# Altium schematic sheet SX1250.SchDoc: SX1250
size A4; Author: Lucas Liaño; Revision: 1; SheetNumber: 4; SheetTotal: 8
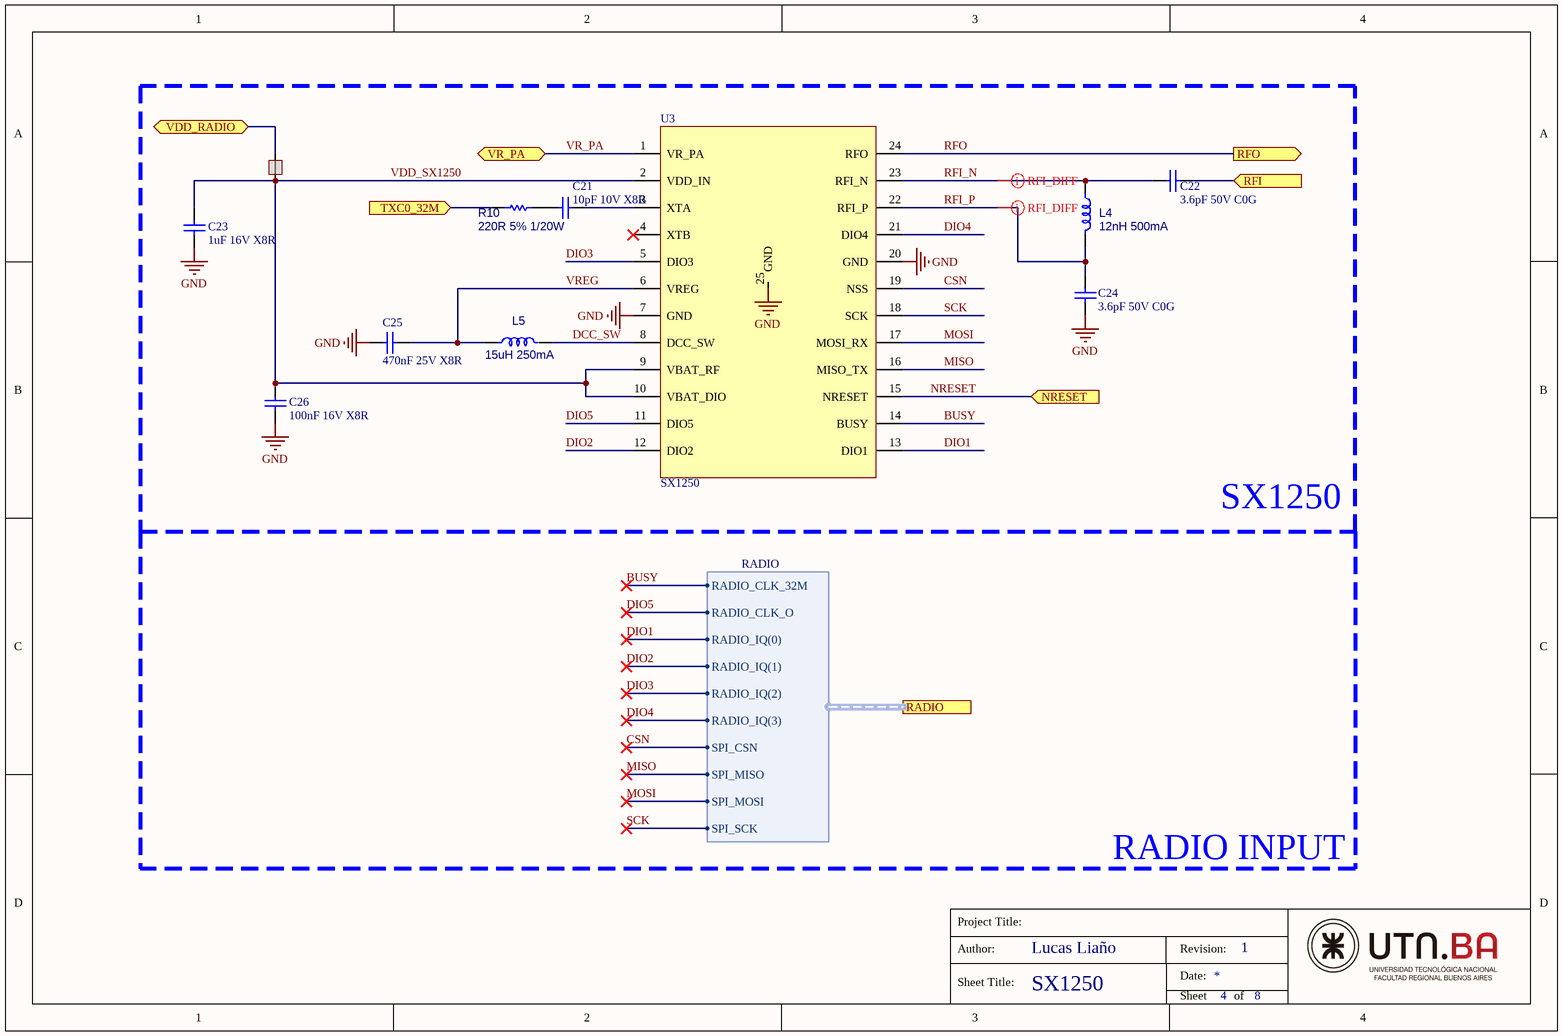
[diagram p0: SX1250.SchDoc]

## Parts
C21  10pF 10V X8R  [C_0603]
C22  3.6pF 50V C0G  [C_0603]
C23  1uF 16V X8R  [C_0603]
C24  3.6pF 50V C0G  [C_0603]
C25  470nF 25V X8R  [C_0603]
C26  100nF 16V X8R  [C_0603]
L4  12nH 500mA  [L_0402]
L5  15uH 250mA  [0805[2012]]
NT16  NT  [NTIE24]  (value not drawn)  (net tie, no BOM)
R10  220R 5% 1/20W  [0603[1608]]
U3  SX1250  [vqfn24_4x4mm]

## Blocks framed on the sheet
SX1250: C21-C26 L4 L5 NT16 R10 U3

## Ports
NRESET (in), RADIO (harness RADIO), RFI (in), RFO (out), TXC0_32M (in), VDD_RADIO (bidir), VR_PA (bidir)

## Harnesses
RADIO: RADIO_CLK_32M, RADIO_CLK_O, RADIO_IQ(0), RADIO_IQ(1), RADIO_IQ(2), RADIO_IQ(3), SPI_CSN, SPI_MISO, SPI_MOSI, SPI_SCK

## Nets
GND: C23.2 C24.2 C25.2 C26.2 U3.7(GND) U3.20(GND) U3.25(GND)
BUSY: U3.14(BUSY) ; port RADIO.RADIO_CLK_32M
CSN: U3.19(NSS) ; port RADIO.SPI_CSN
DCC_SW: L5.2 U3.8(DCC_SW)
DIO1: U3.13(DIO1) ; port RADIO.RADIO_IQ(0)
DIO2: U3.12(DIO2) ; port RADIO.RADIO_IQ(1)
DIO3: U3.5(DIO3) ; port RADIO.RADIO_IQ(2)
DIO4: U3.21(DIO4) ; port RADIO.RADIO_IQ(3)
DIO5: U3.11(DIO5) ; port RADIO.RADIO_CLK_O
MISO: U3.16(MISO_TX) ; port RADIO.SPI_MISO
MOSI: U3.17(MOSI_RX) ; port RADIO.SPI_MOSI
NRESET: U3.15(NRESET) ; port NRESET
RFI: C22.2 ; port RFI
RFI_N: C22.1 L4.1 U3.23(RFI_N)
RFI_P: C24.1 L4.2 U3.22(RFI_P)
RFO: U3.24(RFO) ; port RFO
SCK: U3.18(SCK) ; port RADIO.SPI_SCK
TXC0_32M: R10.1 ; port TXC0_32M
VDD_RADIO: NT16.2 ; port VDD_RADIO
VDD_SX1250: C23.1 C26.1 NT16.1 U3.2(VDD_IN) U3.9(VBAT_RF) U3.10(VBAT_DIO)
VR_PA: U3.1(VR_PA) ; port VR_PA
VREG: C25.1 L5.1 U3.6(VREG)
NetC21_1: C21.1 U3.3(XTA)
NetC21_2: C21.2 R10.2

Not connected (* = marked no-connect by the designer): U3 4(XTB)*

## Layout directives
differential pair; differential pair class RFI_DIFF: RFI_N, RFI_P

## Notes on the sheet
- Project Title:
- RADIO INPUT
- Author:
- Sheet Title:
- Date:
- Revision:
- Sheet
- of

## Library data of the parts
C21 = Cap: Capacitor; MPN: C0603X100J8HACAUTO; Manufacturer: KEMET; Package: 0603; Price (USD): 0.1; ComponentLink2Description: SupplierLink; ComponentLink1Description: Datasheet; ComponentLink2URL: https://www.digikey.com/es/products/detail/kemet/C0603X100J8HACAUTO/8325671; ComponentLink1URL: https://www.digikey.com/es/products/detail/kemet/C0603X100J8HACAUTO/8325671; Value: 10pF 10V X8R; Supplier: Digikey
C22 C24 = Cap: Capacitor; MPN: GJM0335C1H3R6WB01; Manufacturer: Murata Electronics; Package: 0603; Price (USD): 0.2; ComponentLink2Description: SupplierLink; ComponentLink1Description: Datasheet; Value: 3.6pF 50V C0G; Supplier: Digikey
  C22: ComponentLink2URL: *; ComponentLink1URL: *
  C24: ComponentLink2URL: https://www.digikey.com/es/products/detail/murata-electronics/GJM0335C1H3R6WB01D/16033898?s=N4IgTCBcDaIOICkCyAGAzGgrAYQIwAk0AlANgHUAhFXEAXQF8g; ComponentLink1URL: https://www.digikey.com/es/products/detail/murata-electronics/GJM0335C1H3R6WB01D/16033898?s=N4IgTCBcDaIOICkCyAGAzGgrAYQIwAk0AlANgHUAhFXEAXQF8g
C23 = Cap: Capacitor; MPN: CGA4J3X8R1C105K125AB; Manufacturer: TDK Corporation; Package: 0603; Price (USD): 0.4; ComponentLink2Description: SupplierLink; ComponentLink1Description: Datasheet; ComponentLink2URL: *; ComponentLink1URL: *; Value: 1uF 16V X8R; Supplier: Digikey
C25 = Cap: Capacitor; MPN: VJ0603H472JXXAC; Manufacturer: Vishay; Package: 0603; Price (USD): 0.2; ComponentLink2Description: SupplierLink; ComponentLink1Description: Datasheet; ComponentLink2URL: https://www.digikey.com/es/products/detail/vishay-vitramon/VJ0603H472JXXAC/8304887; ComponentLink1URL: https://www.digikey.com/es/products/detail/vishay-vitramon/VJ0603H472JXXAC/8304887; Value: 470nF 25V X8R; Supplier: Digikey
C26 = Cap: Capacitor; MPN: C1206C104K4HACAUTO; Manufacturer: KEMET; Package: 0603; Price (USD): 0.3; ComponentLink2Description: SupplierLink; ComponentLink1Description: Datasheet; ComponentLink2URL: *; ComponentLink1URL: *; Value: 100nF 16V X8R; Supplier: Digikey
L4 = IND: Inductor; Manufacturer: Murata Electronics; MPN: LQW15AN12NH00D; Package: 0402; Price (USD): 0.17; Value: 12nH 500mA; ComponentLink1Description: Datasheet; ComponentLink1URL: https://www.digikey.com/es/products/detail/murata-electronics/LQW15AN12NH00D/2594852?s=N4IgTCBcDaIDIEUDqBGArAQQHIrFgEgAyEAiIAugL5A; ComponentLink2Description: SupplierLink; ComponentLink2URL: https://www.digikey.com/es/products/detail/murata-electronics/LQW15AN12NH00D/2594852?s=N4IgTCBcDaIDIEUDqBGArAQQHIrFgEgAyEAiIAugL5A; Supplier: Digikey
L5 = IND: FIXED IND 15UH 250MA 950MOHM SMD; Manufacturer: TDK Corporation; MPN: MLZ2012M150WT000; Package: 0805; Price (USD): 0.13; Value: 15uH 250mA; ComponentLink1Description: Datasheet; ComponentLink1URL: https://www.digikey.com/es/products/detail/tdk-corporation/MLZ2012M150WT000/2465154; ComponentLink2Description: SupplierLink; ComponentLink2URL: https://www.digikey.com/es/products/detail/tdk-corporation/MLZ2012M150WT000/2465154; Supplier: Digikey
NT16 = NTIE: NET_TIE; ComponentLink1Description: Datasheet; ComponentLink2Description: SupplierLink
R10 = Res: Resistor; Manufacturer: Panasonic Electronic Components; MPN: ERJ-1GNJ221C; Package: 0603; Price (USD): 0.1; Value: 220R 5% 1/20W; ComponentLink1Description: Datasheet; ComponentLink1URL: https://www.digikey.com/es/products/detail/panasonic-electronic-components/ERJ-1GNJ221C/2035771; ComponentLink2Description: SupplierLink; ComponentLink2URL: https://www.digikey.com/es/products/detail/panasonic-electronic-components/ERJ-1GNJ221C/2035771; Supplier: Digikey
U3 = SX1250: SX1250 - Ultra low power RF Front-End; Manufacturer: Semtech; MPN: SX1250IMLTRT; Value: SUB-GHZ RF FRONT END TRANSCIEVER; ComponentLink1Description: Datasheet; ComponentLink1URL: https://semtech.my.salesforce.com/sfc/p/#E0000000JelG/a/2R000000HTAF/wqCYqYPC0Z5rgGvER7_RtmlGeQhc31idv6bvSW4c_FQ; ComponentLink2Description: SupplierLink; ComponentLink2URL: https://www.digikey.com/en/products/detail/semtech-corporation/SX1250IMLTRT/10379521?s=N4IgTCBcDaIM4A8CMYCsAGEBdAvkA; Package: 24-VFQFN; Price (USD): 10; Supplier: Digikey